# EAGLE schematic Luxeon_Turn (EAGLE 6.4)
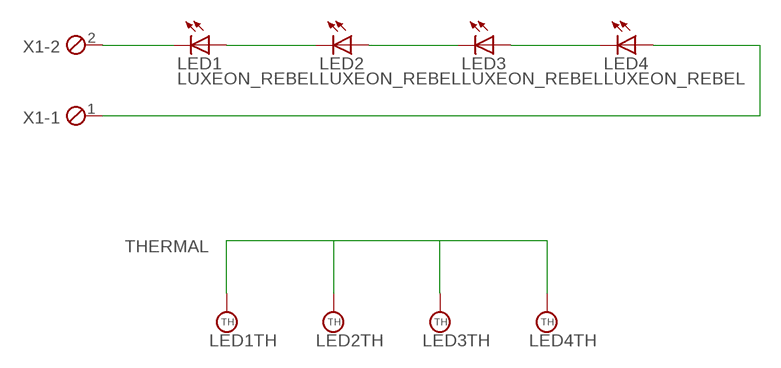
[diagram p0: schematic, sheet 1]

## Parts
LED1  LUXEON_REBEL  [LUXEON_REBEL]
LED2  LUXEON_REBEL  [LUXEON_REBEL]
LED3  LUXEON_REBEL  [LUXEON_REBEL]
LED4  LUXEON_REBEL  [LUXEON_REBEL]
X1  MPT2  [2POL254]

## Nets
N$2: LED1.A LED1.A@1(A) LED2.C LED2.C@1(C)
N$3: LED2.A LED2.A@1(A) LED3.C LED3.C@1(C)
N$4: LED3.A LED3.A@1(A) LED4.C LED4.C@1(C)
THERMAL: LED1.TH LED1.TH@1(TH) LED1.TH@2(TH) LED1.TH@3(TH) LED1.TH@4(TH) LED2.TH LED2.TH@1(TH) LED2.TH@2(TH) LED2.TH@3(TH) LED2.TH@4(TH) LED3.TH LED3.TH@1(TH) LED3.TH@2(TH) LED3.TH@3(TH) LED3.TH@4(TH) LED4.TH LED4.TH@1(TH) LED4.TH@2(TH) LED4.TH@3(TH) LED4.TH@4(TH)
V+: LED4.A LED4.A@1(A) X1.1
V-: LED1.C LED1.C@1(C) X1.2

## Library data of the parts
LED1-LED4 = led:LUXEON_REBEL: LUXEON Rebel Display layer 93, Pins, and connect all contact points with a net. The thermal pads are defined in a separate gate with addlevel REQUEST. Draw a net named 'TH' and connect all thermal pads with it. Please read the Package's Description about DRC settings. Source: http://www.lumileds.com/pdfs/AB32.pdf
X1 = con-phoenix-254:MPT2: PHOENIX CONNECTOR; OC_FARNELL: unknown; OC_NEWARK: unknown